# Altium project TIDA-010042-E2.PrjPcb (part 2 of 3)

## Sheet TIDA-010042-E2_Controller and Bias supply_Pg4.SchDoc: Controller and Bias Supply
size 431 x 279 mm; Date: Not shown in title block; ApprovedBy: Not shown in title block; CheckedBy: Not shown in title block; Author: Not shown in title block; CompanyName: Not shown in title block; DrawnBy: Vaibhavi; Engineer: Not shown in title block; Organization: Not shown in title block; Address1: Not shown in title block; Address2: Not shown in title block; Address3: Not shown in title block; Address4: Not shown in title block; DocumentNumber: 1; Revision: Use project parameter SCH_Rev; SheetNumber: 4; SheetTotal: 5; PageSetup: Record=PageOptions|CenterHorizontal=True|CenterVertical=True|PrintScale=1.00|XCorrection=1.00|YCorrection=1.00|PrintKind=0|BorderSize=5000000|LeftOffset=0|BottomOffset=0|Orientation=2|PaperLength=1000|PaperWidth=1000|Scale=100|PaperSource=15|PrintQuality=600|MediaType=1|DitherType=10|PaperKind=Letter|PrintScaleMode=1; CurrentTime: Not shown in title block; CurrentDate: Not shown in title block; Time: Not shown in title block; DocumentFullPathAndName: Not shown in title block; DocumentName: Not shown in title block; ModifiedDate: Not shown in title block; ImagePath: Not shown in title block
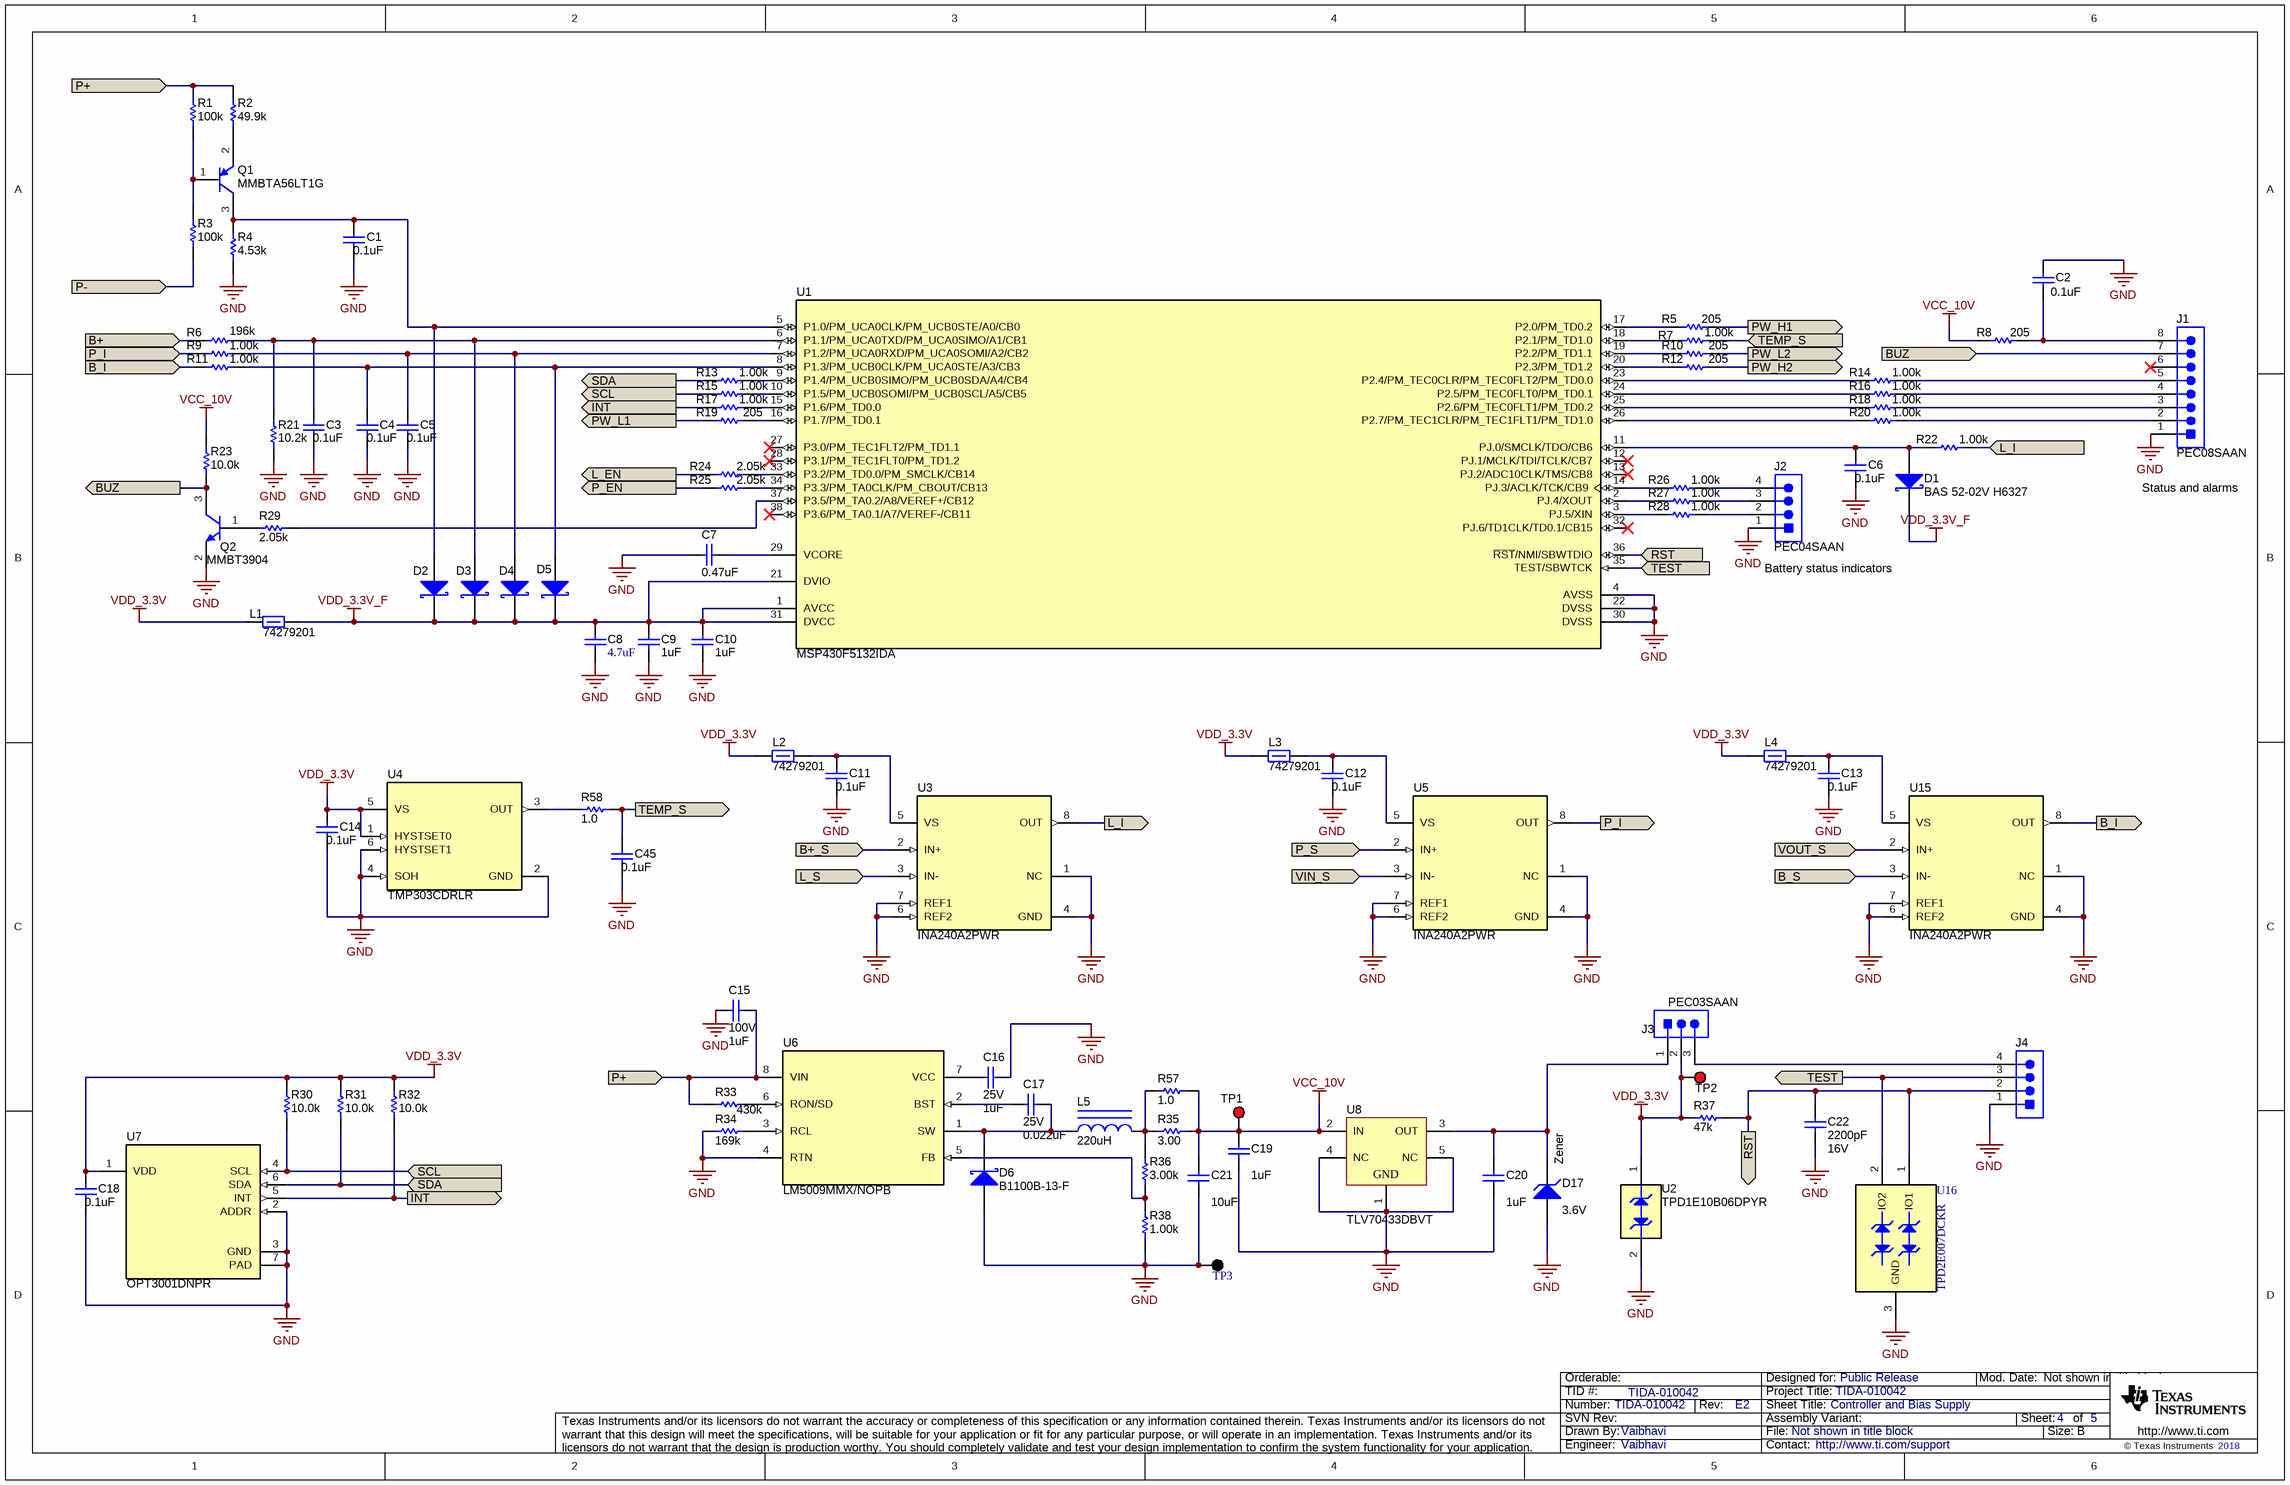
[diagram p1: TIDA-010042-E2_Controller and Bias supply_Pg4.SchDoc]

### Parts
C1  ValueDisplayed: 0.1uF  [0603]  (hidden comment: GMK107BJ104KAHT)
C2  ValueDisplayed: 0.1uF  [0603]  (hidden comment: GMK107BJ104KAHT)
C3  ValueDisplayed: 0.1uF  [0603]  (hidden comment: GMK107BJ104KAHT)
C4  ValueDisplayed: 0.1uF  [0603]  (hidden comment: GMK107BJ104KAHT)
C5  ValueDisplayed: 0.1uF  [0603]  (hidden comment: GMK107BJ104KAHT)
C6  ValueDisplayed: 0.1uF  [0603]  (hidden comment: GMK107BJ104KAHT)
C7  ValueDisplayed: 0.47uF  [0603]  (hidden comment: Capacitor)
C8  value 4.7uF  [0805_HV]  (hidden comment: LMK212B7475MGHT)
C9  ValueDisplayed: 1uF  [0805_HV]  (hidden comment: Capacitor)
C10  ValueDisplayed: 1uF  [0805_HV]  (hidden comment: Capacitor)
C11  ValueDisplayed: 0.1uF  [0603]  (hidden comment: GMK107BJ104KAHT)
C12  ValueDisplayed: 0.1uF  [0603]  (hidden comment: GMK107BJ104KAHT)
C13  ValueDisplayed: 0.1uF  [0603]  (hidden comment: GMK107BJ104KAHT)
C14  ValueDisplayed: 0.1uF  [0603]  (hidden comment: GMK107BJ104KAHT)
C15  VDC_V: 100V  ValueDisplayed: 1uF  [1206_180]  (hidden comment: C3216X7R2A105K160AA)
C16  VDC_V: 25V  ValueDisplayed: 1uF  [0805_HV]  (hidden comment: C2012X7R1H105K125AE)
C17  VDC_V: 25V  ValueDisplayed: 0.022uF  [0603]  (hidden comment: C0603C223K3RACTU)
C18  ValueDisplayed: 0.1uF  [0603]  (hidden comment: GMK107BJ104KAHT)
C19  ValueDisplayed: 1uF  [0603]  (hidden comment: C1608X7R1E105K080AB)
C20  ValueDisplayed: 1uF  [0603]  (hidden comment: C1608X7R1E105K080AB)
C21  ValueDisplayed: 10uF  [1206_190]  (hidden comment: EMK316AB7106KL-T)
C22  ValueDisplayed: 2200pF  VDC_V: 16V  [0603]  (hidden comment: 885012206036)
C45  ValueDisplayed: 0.1uF  [0603]  (hidden comment: GMK107BJ104KAHT)
D1  BAS 52-02V H6327  [SOD-523]
D2  BAS 52-02V H6327  [SOD-523]  (value not drawn)
D3  BAS 52-02V H6327  [SOD-523]  (value not drawn)
D4  BAS 52-02V H6327  [SOD-523]  (value not drawn)
D5  BAS 52-02V H6327  [SOD-523]  (value not drawn)
D6  B1100B-13-F  [SMB]
D17  Zener  value 3.6V  [SOD-123]
J1  PEC08SAAN  [SULLINS_PEC08SAAN]
J2  PEC04SAAN  [SULLINS_PEC04SAAN]
J3  PEC03SAAN  [CONN_PEC03SAAN]
J4  PEC04SAAN  [SULLINS_PEC04SAAN]  (value not drawn)
L1  74279201  [0805_HV]
L2  74279201  [0805_HV]
L3  74279201  [0805_HV]
L4  74279201  [0805_HV]
L5  ValueDisplayed: 220uH  [SLF10145]  (hidden comment: SLF10145T-221MR65-PF)
Q1  MMBTA56LT1G  [SOT-23]
Q2  MMBT3904  [SOT-23]
R1  ValueDisplayed: 100k  [0805_HV]  (hidden comment: MCU08050C1003FP500)
R2  ValueDisplayed: 49.9k  [0805_HV]  (hidden comment: CRCW080549K9FKEA)
R3  ValueDisplayed: 100k  [0805_HV]  (hidden comment: MCU08050C1003FP500)
R4  ValueDisplayed: 4.53k  [0805_HV]  (hidden comment: CRCW08054K53FKEA)
R5  ValueDisplayed: 205  [0603]  (hidden comment: RC0603FR-07205RL)
R6  ValueDisplayed: 196k  [0805_HV]  (hidden comment: CRCW0805196KFKEA)
R7  ValueDisplayed: 1.00k  [0603]  (hidden comment: Resistor)
R8  ValueDisplayed: 205  [0603]  (hidden comment: RC0603FR-07205RL)
R9  ValueDisplayed: 1.00k  [0603]  (hidden comment: Resistor)
R10  ValueDisplayed: 205  [0603]  (hidden comment: RC0603FR-07205RL)
R11  ValueDisplayed: 1.00k  [0603]  (hidden comment: Resistor)
R12  ValueDisplayed: 205  [0603]  (hidden comment: RC0603FR-07205RL)
R13  ValueDisplayed: 1.00k  [0603]  (hidden comment: Resistor)
R14  ValueDisplayed: 1.00k  [0603]  (hidden comment: Resistor)
R15  ValueDisplayed: 1.00k  [0603]  (hidden comment: Resistor)
R16  ValueDisplayed: 1.00k  [0603]  (hidden comment: Resistor)
R17  ValueDisplayed: 1.00k  [0603]  (hidden comment: Resistor)
R18  ValueDisplayed: 1.00k  [0603]  (hidden comment: Resistor)
R19  ValueDisplayed: 205  [0603]  (hidden comment: RC0603FR-07205RL)
R20  ValueDisplayed: 1.00k  [0603]  (hidden comment: Resistor)
R21  ValueDisplayed: 10.2k  [0603]  (hidden comment: RC0603FR-0710K2L)
R22  ValueDisplayed: 1.00k  [0603]  (hidden comment: Resistor)
R23  ValueDisplayed: 10.0k  [0603]  (hidden comment: ERJ-3EKF1002V)
R24  ValueDisplayed: 2.05k  [0603]  (hidden comment: RC0603FR-072K05L)
R25  ValueDisplayed: 2.05k  [0603]  (hidden comment: RC0603FR-072K05L)
R26  ValueDisplayed: 1.00k  [0603]  (hidden comment: Resistor)
R27  ValueDisplayed: 1.00k  [0603]  (hidden comment: Resistor)
R28  ValueDisplayed: 1.00k  [0603]  (hidden comment: Resistor)
R29  ValueDisplayed: 2.05k  [0603]  (hidden comment: RC0603FR-072K05L)
R30  ValueDisplayed: 10.0k  [0603]  (hidden comment: ERJ-3EKF1002V)
R31  ValueDisplayed: 10.0k  [0603]  (hidden comment: ERJ-3EKF1002V)
R32  ValueDisplayed: 10.0k  [0603]  (hidden comment: ERJ-3EKF1002V)
R33  ValueDisplayed: 430k  [0603]  (hidden comment: CRCW0603430KFKEA)
R34  ValueDisplayed: 169k  [0603]  (hidden comment: CRCW0603169KFKEA)
R35  ValueDisplayed: 3.00  [0603]  (hidden comment: CRCW06033R00JNEA)
R36  ValueDisplayed: 3.00k  [0603]  (hidden comment: RC0603FR-073KL)
R37  ValueDisplayed: 47k  [0603]  (hidden comment: RC0603JR-0747KL)
R38  ValueDisplayed: 1.00k  [0603]  (hidden comment: Resistor)
R57  ValueDisplayed: 1.0  [0603]  (hidden comment: CRCW06031R00JNEA)
R58  ValueDisplayed: 1.0  [0603]  (hidden comment: CRCW06031R00JNEA)
TP1  5000  [Keystone5000]  (value not drawn)
TP2  5000  [Keystone5000]  (value not drawn)
TP3  5001  [Keystone5001]  (value not drawn)
U1  MSP430F5132IDA  [DA0038A_N]
U2  TPD1E10B06DPYR  [DPY0002A]
U3  INA240A2PWR  [PW0008A_L]
U4  TMP303CDRLR  [DRL0006A]
U5  INA240A2PWR  [PW0008A_L]
U6  LM5009MMX/NOPB  [DGK0008A_N]
U7  OPT3001DNPR  [DNP0006A]
U8  TLV70433DBVT  [DBV0005A_N]
U15  INA240A2PWR  [PW0008A_L]
U16  TPD2E007DCKR  [DCK0003A_L]

### Ports
B+ (in), B+_S (in), B_I (in), B_I (out), B_S (in), BUZ (in), BUZ (out), INT (out), L_EN (out), L_I (in), L_I (out), L_S (in), P+ (in), P- (in), P_EN (out), P_I (in), P_I (out), P_S (in), PW_H1 (out), PW_H2 (out), PW_L1 (out), PW_L2 (out), RST (in), RST (out), SCL (in), SCL (out), SDA (in), SDA (out), TEMP_S (in), TEMP_S (out), TEST (in), TEST (out), VIN_S (in), VOUT_S (in)

### Nets
GND: C1.2 C2.1 C3.2 C4.2 C5.2 C6.2 C7.1 C8.2 C9.2 C10.2 C11.2 C12.2 C13.2 C14.2 C15.2 C16.1 C18.2 C19.2 C20.2 C21.2 C22.2 C45.2 D6.2(A) D17.2(A) J1.1 J2.1 J4.1 Q2.2(E) R4.1 R21.1 R34.1 R38.1 TP3.1 U1.4(AVSS) U1.22(DVSS) U1.30(DVSS) U2.2(A) U3.1(NC) U3.4(GND) U3.6(REF2) U3.7(REF1) U4.2(GND) U4.4(SOH) U4.6(HYSTSET1) U5.1(NC) U5.4(GND) U5.6(REF2) U5.7(REF1) U6.4(RTN) U7.2(ADDR) U7.3(GND) U7.7(PAD) U8.1(GND) U8.4(NC) U8.5(NC) U15.1(NC) U15.4(GND) U15.6(REF2) U15.7(REF1) U16.3(GND)
VCC_10V: C19.1 C21.1 R8.1 R23.1 R35.2 R57.2 TP1.1 U8.2(IN)
VDD_3.3V: C14.1 C18.1 J3.2 L1.1 L2.2 L3.2 L4.2 R30.2 R31.2 R32.2 R37.1 TP2.1 U2.1(K) U4.1(HYSTSET0) U4.5(VS) U7.1(VDD)
VDD_3.3V_F: C8.1 C9.1 C10.1 D1.1(K) D2.1(K) D3.1(K) D4.1(K) D5.1(K) L1.2 U1.1(AVCC) U1.21(DVIO) U1.31(DVCC)
B+: R6.1 U3.2(IN+) U15.3(IN-) ; port B+_S, port B_S, port B+
B_I: R11.1 U15.8(OUT) ; port B_I
BUZ: J1.7 Q2.3(C) R23.2 ; port BUZ
INT: R17.1 R32.1 U7.5(INT) ; port INT
L+: U3.3(IN-) ; port L_S
L_EN: R24.1 ; port L_EN
L_I: R22.2 U3.8(OUT) ; port L_I
P+: C15.1 R1.2 R2.2 R33.1 U5.2(IN+) U6.8(VIN) ; port P+, port P_S
P-: R3.1 ; port P-
P_EN: R25.1 ; port P_EN
P_I: R9.1 U5.8(OUT) ; port P_I
PW_H1: R5.2 ; port PW_H1
PW_H2: R12.2 ; port PW_H2
PW_L1: R19.1 ; port PW_L1
PW_L2: R10.2 ; port PW_L2
RST: C22.1 J4.2 R37.2 U1.36(~{RST}/NMI/SBWTDIO) U16.1(IO1) ; port RST
SCL: R15.1 R30.1 U7.4(SCL) ; port SCL
SDA: R13.1 R31.1 U7.6(SDA) ; port SDA
TEMP_S: C45.1 R7.2 R58.2 ; port TEMP_S
TEST: J4.3 U1.35(TEST/SBWTCK) U16.2(IO2) ; port TEST
V_IN: U5.3(IN-) ; port VIN_S
V_OUT: U15.2(IN+) ; port VOUT_S
NetC1_1: C1.1 D2.2(A) Q1.3(C) R4.2 U1.5(P1.0/PM_UCA0CLK/PM_UCB0STE/A0/CB0)
NetC2_2: C2.2 J1.8 R8.2
NetC3_1: C3.1 D3.2(A) R6.2 R21.2 U1.6(P1.1/PM_UCA0TXD/PM_UCA0SIMO/A1/CB1)
NetC4_1: C4.1 D5.2(A) R11.2 U1.8(P1.3/PM_UCB0CLK/PM_UCA0STE/A3/CB3)
NetC5_1: C5.1 D4.2(A) R9.2 U1.7(P1.2/PM_UCA0RXD/PM_UCA0SOMI/A2/CB2)
NetC6_1: C6.1 D1.2(A) R22.1 U1.11(PJ.0/SMCLK/TDO/CB6)
NetC7_2: C7.2 U1.29(VCORE)
NetC11_1: C11.1 L2.1 U3.5(VS)
NetC12_1: C12.1 L3.1 U5.5(VS)
NetC13_1: C13.1 L4.1 U15.5(VS)
NetC16_2: C16.2 U6.7(VCC)
NetC17_1: C17.1 D6.1(K) L5.1 U6.1(SW)
NetC17_2: C17.2 U6.2(BST)
NetC20_1: C20.1 D17.1(K) J3.1 U8.3(OUT)
NetJ1_2: J1.2 R20.2
NetJ1_3: J1.3 R18.2
NetJ1_4: J1.4 R16.2
NetJ1_5: J1.5 R14.2
NetJ2_2: J2.2 R28.2
NetJ2_3: J2.3 R27.2
NetJ2_4: J2.4 R26.2
NetJ3_3: J3.3 J4.4
NetL5_2: L5.2 R35.1 R36.2 R57.1
NetQ1_1: Q1.1(B) R1.1 R3.2
NetQ1_2: Q1.2(E) R2.1
NetQ2_1: Q2.1(B) R29.1
NetR5_1: R5.1 U1.17(P2.0/PM_TD0.2)
NetR7_1: R7.1 U1.18(P2.1/PM_TD1.0)
NetR10_1: R10.1 U1.19(P2.2/PM_TD1.1)
NetR12_1: R12.1 U1.20(P2.3/PM_TD1.2)
NetR13_2: R13.2 U1.9(P1.4/PM_UCB0SIMO/PM_UCB0SDA/A4/CB4)
NetR14_1: R14.1 U1.23(P2.4/PM_TEC0CLR/PM_TEC0FLT2/PM_TD0.0)
NetR15_2: R15.2 U1.10(P1.5/PM_UCB0SOMI/PM_UCB0SCL/A5/CB5)
NetR16_1: R16.1 U1.24(P2.5/PM_TEC0FLT0/PM_TD0.1)
NetR17_2: R17.2 U1.15(P1.6/PM_TD0.0)
NetR18_1: R18.1 U1.25(P2.6/PM_TEC0FLT1/PM_TD0.2)
NetR19_2: R19.2 U1.16(P1.7/PM_TD0.1)
NetR20_1: R20.1 U1.26(P2.7/PM_TEC1CLR/PM_TEC1FLT1/PM_TD1.0)
NetR24_2: R24.2 U1.33(P3.2/PM_TD0.0/PM_SMCLK/CB14)
NetR25_2: R25.2 U1.34(P3.3/PM_TA0CLK/PM_CBOUT/CB13)
NetR26_1: R26.1 U1.14(PJ.3/ACLK/TCK/CB9)
NetR27_1: R27.1 U1.2(PJ.4/XOUT)
NetR28_1: R28.1 U1.3(PJ.5/XIN)
NetR29_2: R29.2 U1.37(P3.5/PM_TA0.2/A8/VEREF+/CB12)
NetR33_2: R33.2 U6.6(RON/SD)
NetR34_2: R34.2 U6.3(RCL)
NetR36_1: R36.1 R38.2 U6.5(FB)
NetR58_1: R58.1 U4.3(OUT)

Not connected (* = marked no-connect by the designer): J1 6*; U1 12(PJ.1/MCLK/TDI/TCLK/CB7)* 13(PJ.2/ADC10CLK/TMS/CB8)* 27(P3.0/PM_TEC1FLT2/PM_TD1.1)* 28(P3.1/PM_TEC1FLT0/PM_TD1.2)* 32(PJ.6/TD1CLK/TD0.1/CB15)* 38(P3.6/PM_TA0.1/A7/VEREF-/CB11)*

### Notes on the sheet
- (near J1) Status and alarms
- (near J2) Battery status indicators
- Drawn By:
- SVN Rev:
- Number:
- TID #:
- Orderable:
- Rev:
- Sheet Title:
- File:
- Project Title:
- Designed for:
- Assembly Variant:
- Mod. Date:
- Sheet:
- Size:
- of
- B
- http://www.ti.com
- Texas Instruments and/or its licensors do not warrant the accuracy or completeness of this specification or any information contained therein. Texas Instruments and/or its licensors do not warrant that this design will meet the specifications, will be suitable for your application or fit for any particular purpose, or will operate in an implementation. Texas Instruments and/or its licensors do not warrant that the design is production worthy. You should completely validate and test your design implementation to confirm the system functionality for your application.
- Engineer:
- Contact:
- © Texas Instruments

### Library data of the parts
C1-C6 C11-C14 C18 C45 = CMP-0007044-5: CAP CER 0.1UF 25V X5R 0603; Manufacturer: Taiyo Yuden; PartNumber: TMK107BJ104KA-T; TaMin_C: -55°C; ESR_ohm: 0.0296; Polarized: N; TempCo: X7R; SizeAreaWB_mm2: 4.68; Value1: 0.0296 ohm; U/M: EA; TaMax_C: 125°C; Tolerance_%: 10%; SizeZ_mm: 1; SizeX_mm: 1.6; SizeY_mm: 0.8; SizeArea_mm2: 1.28; CompType: Capacitor; Cap_F: 100nF; IRMS_A: 9.7199dA; AEC Category: Q200; Publisher: Texas Instruments; Published: 2008-06-19; RoHS: Y; MountType: SMT; Value: 0.1uF; Supplier 1: Digi-Key; PackageReference: 0603; Cap_Case: 0603; Value2: 25V; LatestRevisionDate: 2017-03-09; AEC Qualified: N; VDC_V: 25V; ComponentLink1Description: Datasheet link; AEC Grade: N/A; Supplier Part Number 1: 587-1245-1-ND; Technology: Ceramic; ComponentLink1URL: https://product.tdk.com/en/search/capacitor/ceramic/mlcc/info?part_no=C1608X7R1H104K080AA
C7 = CMP-0007328-5: CAP, CERM, 0.47 uF, 10 V, +/- 10%, X5R, 0603; PartNumber: GRM188R61A474KA61D; Manufacturer: MuRata; Polarized: N; Value: 0.47uF; U/M: EA; Cap_F: 470nF; Value1: Unknown; VDC_V: 10V; TaMin_C: -55°C; TaMax_C: 85°C; SizeArea_mm2: 1.28; SizeAreaWB_mm2: 4.68; SizeX_mm: 1.6; SizeY_mm: 0.8; SizeZ_mm: 1; AEC Category: Q200; CompType: Capacitor; PackageReference: 0603; RoHS: Y; Tolerance_%: 10%; Value2: 10V; MountType: SMT; Technology: Ceramic; TempCo: X5R; Cap_Case: 0603; Published: 2008-06-19; Publisher: Texas Instruments; LatestRevisionDate: 2017-03-09; ComponentLink1Description: Datasheet link; ComponentLink1URL: http://search.murata.co.jp/Ceramy/PnsearchViewAction.do?HnOFG=ON&HnNFG=ON&SEL_CNT=50&sLang=en&sKey=GRM188R61A474KA61D&x=9&y=9&search=startwith; Supplier 1: Digi-Key; Supplier Part Number 1: 490-1539-1-ND; Supplier 2: Mouser; Supplier Part Number 2: 81-GRM39R474K10; Supplier 3: Farnell; Supplier Part Number 3: 1403755; AEC Qualified: ?
C8 = CMP-0007690-2: CAP, CERM, 4.7 uF, 10 V, +/- 10%, X7R, 0805; Manufacturer: Taiyo Yoden; TaMin_C: -55°C; Polarized: N; SizeAreaWB_mm2: 6.75; Value1: Unknown; U/M: EA; TaMax_C: 125°C; SizeZ_mm: 1.45; SizeX_mm: 2; SizeY_mm: 1.25; Cap_Case: 0805; Value2: 10V; SizeArea_mm2: 2.5; CompType: Capacitor; Cap_F: 4.7µF; AEC Category: Q200; Publisher: Texas Instruments; TempCo: X7R; Published: 2008-06-19; RoHS: Y; MountType: SMT; Supplier 1: Digi-Key; PackageReference: 0805; Tolerance_%: 10%; LatestRevisionDate: 2017-03-09; PartNumber: LMK212B7475MGHT; AEC Qualified: N; VDC_V: 10V; ComponentLink1Description: Datasheet link; AEC Grade: N/A; Supplier Part Number 1: 587-4916-1-ND; Technology: Ceramic; ValueDisplayed: 4.7uF; ComponentLink1URL: http://katalog.we-online.de/pbs/datasheet/885012207025.pdf
C9 C10 = CMP-0064942-2: CAP, CERM, 1 uF, 10 V,+/- 10%, X7R, AEC-Q200 Grade 1, 0805; PartNumber: C0805C105K8RACAUTO; Manufacturer: Kemet; Polarized: N; Value: 1uF; U/M: EA; Cap_F: 1µF; Value1: Unknown; VDC_V: 10V; TaMin_C: -55°C; TaMax_C: 125°C; Cap_Case: 0805; SizeArea_mm2: 2.5; SizeAreaWB_mm2: 6.75; SizeX_mm: 2; SizeY_mm: 1.25; SizeZ_mm: 1.45; AEC Category: Q200; AEC Qualified: Y; AEC Grade: 1; CompType: Capacitor; PackageReference: 0805; RoHS: Y; Tolerance_%: 10%; Value2: 10V; MountType: SMT; Technology: Ceramic; TempCo: X7R; Published: 2008-06-19; Publisher: Texas Instruments; LatestRevisionDate: 2017-06-05; ComponentLink1Description: Datasheet link; ComponentLink1URL: http://www.kemet.com/docfinder?Partnumber=C0805C105K8RACAUTO; Supplier 1: Digi-Key; Supplier Part Number 1: 399-6931-1-ND; Supplier 2: Newark; Supplier Part Number 2: 47Y9732; Supplier 3: Mouser; Supplier Part Number 3: 80-C0805C105K8RAUTO
C15 = CMP-0008710-2: CAP, CERM, 1 uF, 100 V, +/- 10%, X7R, 1206; Manufacturer: TDK; PartNumber: C3216X7R2A105M160AA; TaMin_C: -55°C; ESR_ohm: 4.575m; Polarized: N; SizeAreaWB_mm2: 10.92; Value1: 0.004575 ohm; U/M: EA; Value: 1uF; TaMax_C: 125°C; SizeZ_mm: 1.8; SizeX_mm: 3.2; SizeY_mm: 1.6; SizeArea_mm2: 5.12; Cap_F: 1µF; IRMS_A: 3.39639A; AEC Category: Q200; Publisher: Texas Instruments; TempCo: X7R; Published: 2008-06-19; RoHS: Y; MountType: SMT; Supplier 1: Digi-Key; PackageReference: 1206; Tolerance_%: 10%; Cap_Case: 1206_180; Value2: 100V; CompType: Capacitor; LatestRevisionDate: 2017-03-09; AEC Qualified: N; ComponentLink1Description: Datasheet link; AEC Grade: N/A; Supplier Part Number 1: 445-4468-2-ND; Technology: Ceramic; ComponentLink1URL: https://product.tdk.com/en/search/capacitor/ceramic/mlcc/info?part_no=C3216X7R2A105K160AA
C16 = CMP-0007730-2: CAP CER 1UF 25V X7R 0805; Manufacturer: Wurth Electronics Inc.; PartNumber: 885012207078; TaMin_C: -55°C; Polarized: N; SizeAreaWB_mm2: 6.75; Value1: Unknown; U/M: EA; TaMax_C: 125°C; Tolerance_%: 10%; SizeZ_mm: 1.45; SizeX_mm: 2; SizeY_mm: 1.25; Cap_Case: 0805; SizeArea_mm2: 2.5; CompType: Capacitor; Cap_F: 1µF; AEC Category: Q200; Publisher: Texas Instruments; TempCo: X7R; Published: 2008-06-19; RoHS: Y; MountType: SMT; Value: 1uF; Supplier 1: Digi-Key; PackageReference: 0805; Value2: 25V; LatestRevisionDate: 2017-03-09; AEC Qualified: N; ComponentLink1Description: Datasheet link; AEC Grade: N/A; Supplier Part Number 1: 732-7672-1-ND; Technology: Ceramic; ComponentLink1URL: http://www.kemet.com/docfinder?Partnumber=C0805C105K5RACTU
C17 = CMP-0006899-4: CAP CER 0.022UF 25V X7R 0603; Manufacturer: Samsung Electro-Mechanics; PartNumber: CL10B223KA8NNWC; TaMin_C: -55°C; Polarized: N; SizeAreaWB_mm2: 4.68; Value1: Unknown; U/M: EA; TaMax_C: 125°C; Tolerance_%: 10%; SizeZ_mm: 1; SizeX_mm: 1.6; SizeY_mm: 0.8; SizeArea_mm2: 1.28; CompType: Capacitor; Cap_F: 22nF; AEC Category: Q200; Publisher: Texas Instruments; TempCo: X7R; Published: 2008-06-19; RoHS: Y; MountType: SMT; Value: 0.022uF; Supplier 1: Digi-Key; PackageReference: 0603; Cap_Case: 0603; Value2: 25V; LatestRevisionDate: 2017-03-09; AEC Qualified: ?; ComponentLink1Description: Datasheet link; Supplier Part Number 1: 1276-2000-1-ND; Technology: Ceramic; ComponentLink1URL: http://www.kemet.com/kemet/web/homepage/kechome.nsf/vapubfiles/F3102_Y5V.pdf/$file/F3102_Y5V.pdf
C19 C20 = CMP-0006831-4: CAP CER 1UF 16V Y5V 0603; Manufacturer: Yageo; PartNumber: CC0603MRY5V7BB105; TaMin_C: -55°C; Polarized: N; TempCo: X7R; SizeAreaWB_mm2: 4.68; Value1: Unknown; U/M: EA; TaMax_C: 125°C; Tolerance_%: 10%; SizeZ_mm: 1; SizeX_mm: 1.6; SizeY_mm: 0.8; SizeArea_mm2: 1.28; CompType: Capacitor; Cap_F: 1µF; AEC Category: Q200; Publisher: Texas Instruments; Published: 2008-06-19; RoHS: Y; MountType: SMT; Value: 1uF; Supplier 1: Digi-Key; PackageReference: 0603; Cap_Case: 0603; Value2: 16V; LatestRevisionDate: 2017-03-09; AEC Qualified: N; VDC_V: 16V; ComponentLink1Description: Datasheet link; AEC Grade: N/A; Supplier Part Number 1: 311-3414-1-ND; Technology: Ceramic; ComponentLink1URL: http://katalog.we-online.de/pbs/datasheet/885012206052.pdf
C21 = CMP-0008570-2: CAP CER 10UF 16V X7R 1206; Manufacturer: Samsung Electro-Mechanics; PartNumber: CL31B106KOHZW6E; TaMin_C: -55°C; Polarized: N; SizeAreaWB_mm2: 10.92; Value1: Unknown; U/M: EA; TaMax_C: 125°C; Tolerance_%: 10%; SizeZ_mm: 1.9; SizeX_mm: 3.2; SizeY_mm: 1.6; Cap_Case: 1206; SizeArea_mm2: 5.12; CompType: Capacitor; Cap_F: 10µF; AEC Category: Q200; Publisher: Texas Instruments; TempCo: X7R; Published: 2008-06-19; RoHS: Y; MountType: SMT; Value: 10uF; Supplier 1: Digi-Key; PackageReference: 1206_190; Value2: 16V; LatestRevisionDate: 2017-03-09; AEC Qualified: N; VDC_V: 16V; ComponentLink1Description: Datasheet link; AEC Grade: N/A; Supplier Part Number 1: 1276-7032-1-ND; Technology: Ceramic; ComponentLink1URL: http://datasheets.avx.com/X7RDielectric.pdf
C22 = CMP-0006827-4: CAP, CERM, 2200 pF, 16 V, +/- 10%, X7R, 0603; Manufacturer: Wurth Elektronik; Polarized: N; Value: 2200pF; U/M: EA; Cap_F: 2.2nF; Value1: Unknown; TaMin_C: -55°C; TaMax_C: 125°C; SizeArea_mm2: 1.28; SizeAreaWB_mm2: 4.68; SizeX_mm: 1.6; SizeY_mm: 0.8; SizeZ_mm: 1; AEC Category: Q200; CompType: Capacitor; PartNumber: 885012206036; PackageReference: 0603; RoHS: Y; Tolerance_%: 10%; Value2: 16V; MountType: SMT; Technology: Ceramic; TempCo: X7R; Cap_Case: 0603; Published: 2008-06-19; Publisher: Texas Instruments; LatestRevisionDate: 2017-03-09; ComponentLink1Description: Datasheet link; ComponentLink1URL: http://katalog.we-online.de/pbs/datasheet/885012206036.pdf; Supplier 1: Mouser; Supplier Part Number 1: 710-885012206036; AEC Qualified: N; AEC Grade: N/A
D1-D5 = CMP-0028606-2: Diode, Schottky, 45 V, 0.75 A, SOD-523; Manufacturer: Infineon Technologies; Io_A: 7.5dA; Green_Lifecycle: Not Set; SizeAreaWB_mm2: 5.13; Vr_V: 45V; Green_REACh: Incomplete; Value1: 0.75A; TJmax_C: 150°C; U/M: EA; Value: 45V; SizeZ_mm: 0.65; SizeX_mm: 1.7; SizeY_mm: 0.9; Vf_V: 6dV; Value2: 0.6V; SizeArea_mm2: 1.53; AEC Category: Q101; ComponentLink1URL: http://www.infineon.com/dgdl/bas52series.pdf?folderId=db3a304313d846880113def5812204a1&fileId=db3a304313e278750113e2a3a5490006; Supplier Part Number 2: 726-BAS5202VH6327; Publisher: Texas Instruments; Supplier 2: Mouser; Published: 2008-06-26; RoHS: Y; MountType: SMT; Green_EU RoHS-2: Incomplete; Supplier 1: Digi-Key; Green_EU RoHS: Incomplete; PackageReference: SOD-523; CompType: Diode; Type: Schottky; LatestRevisionDate: 2017-05-08; PartNumber: BAS 52-02V H6327; AEC Qualified: ?; ComponentLink1Description: Datasheet link; Supplier Part Number 1: BAS 52-02V H6327CT-ND
D6 = CMP-0028372-1: Diode, Schottky, 100 V, 1 A, SMB; Manufacturer: Diodes Inc.; Io_A: 1A; Green_Lifecycle: Not Set; SizeAreaWB_mm2: 44.156; Vr_V: 100V; Green_REACh: Incomplete; TJmax_C: 150°C; U/M: EA; Value: 100V; SizeZ_mm: 2.6; SizeX_mm: 5.6; SizeY_mm: 3.81; Vf_V: 7.9dV; Value2: 0.79V; SizeArea_mm2: 21.336; AEC Category: Q101; RJC_CperW: 25; ComponentLink1URL: http://www.diodes.com/datasheets/ds30018.pdf; Supplier Part Number 2: 621-B1100B-F; Publisher: Texas Instruments; Supplier 2: Mouser; Published: 2008-06-26; RoHS: Y; Value1: 1A; MountType: SMT; Green_EU RoHS-2: Incomplete; Supplier 1: Digi-Key; Green_EU RoHS: Incomplete; PackageReference: SMB; CompType: Diode; Type: Schottky; LatestRevisionDate: 2017-05-08; PartNumber: B1100B-13-F; AEC Qualified: ?; ComponentLink1Description: Datasheet link; Supplier Part Number 1: B1100B-FDICT-ND
D17 = CMP-0005782-1: Diode, Zener, 3.6 V, 500 mW, SOD-123; PartNumber: MMSZ4685T1G; Manufacturer: ON Semiconductor; U/M: EA; Power_W: 500mW; Value1: 0.5W; RJA_CperW: 340; SizeAreaWB_mm2: 13.095; SizeArea_mm2: 6.545; SizeX_mm: 3.85; SizeY_mm: 1.7; SizeZ_mm: 1.35; AEC Category: Q101; PackageReference: SOD-123; CompType: Zener; Vz_V: 3.6V; MountType: SMT; RoHS: Y; ComponentLink1Description: Datasheet link; ComponentLink1URL: http://www.onsemi.com/pub_link/Collateral/MMSZ4678T1-D.PDF; Published: 2008-10-08; Publisher: Texas Instruments; LatestRevisionDate: 2017-03-09; LatestRevisionNote: Updated Supplier Data; Supplier 1: Digi-Key; Supplier Part Number 1: MMSZ4685T1GOSCT-ND; Supplier 2: Mouser; Supplier Part Number 2: 863-MMSZ4685T1G; Supplier 3: Farnell; Supplier Part Number 3: 1651592; AEC Qualified: ?
J1 = CMP-0054563-1: Header, 100mil, 8x1, Tin, TH; Manufacturer: Sullins Connector Solutions; CNHeader: TRUE; Current_A: 3A; Green_Lifecycle: Not Set; Shrouded: N; Gender: Male; Green_REACh: Incomplete; Voltage_V: 1.8kV; Row_Count: 1; Pitch_mm: 2.54; CT: FALSE; Cert_UL: Y; ComponentLink1URL: http://www.sullinscorp.com/catalogs/77_PAGE108-109_.100_MALE_HDR.pdf; ClassName: Header; Publisher: Texas Instruments; Color: Black; RoHS: Y; MountType: TH; Green_EU RoHS-2: Incomplete; Supplier 1: Digi-Key; Green_EU RoHS: Incomplete; PackageReference: Header, 8x1, 100mil, TH; PinCount: 8; CompType: Header; LatestRevisionDate: 26/05/2017; PartNumber: PEC08SAAN; Orientation: Vertical; ComponentLink1Description: Datasheet URL; Supplier Part Number 1: S1012E-08-ND; ContactFinish: Tin
J2 J4 = CMP-0054562-1: Header, 100mil, 4x1, Tin, TH; Manufacturer: Sullins Connector Solutions; CNHeader: TRUE; Current_A: 3A; Green_Lifecycle: Not Set; Shrouded: N; Gender: Male; Green_REACh: Incomplete; Voltage_V: 1.8kV; Row_Count: 1; Pitch_mm: 2.54; CT: FALSE; Cert_UL: Y; ComponentLink1URL: http://www.sullinscorp.com/catalogs/77_PAGE108-109_.100_MALE_HDR.pdf; ClassName: Header; Publisher: Texas Instruments; Color: Black; RoHS: Y; MountType: TH; Green_EU RoHS-2: Incomplete; Supplier 1: Digi-Key; Green_EU RoHS: Incomplete; PackageReference: Header, 4x1, 100mil, TH; PinCount: 4; CompType: Header; LatestRevisionDate: 26/05/2017; PartNumber: PEC04SAAN; Orientation: Vertical; ComponentLink1Description: Datasheet URL; Supplier Part Number 1: S1012E-04-ND; ContactFinish: Tin
J3 = CMP-0002338-1: Header, 100mil, 3x1, Tin, TH; Manufacturer: Sullins Connector Solutions; CNHeader: TRUE; Current_A: 3A; Green_Lifecycle: Not Set; Shrouded: N; Gender: Male; Green_REACh: Incomplete; Voltage_V: 1.8kV; Row_Count: 1; Pitch_mm: 2.54; CT: FALSE; Cert_UL: Y; ComponentLink1URL: http://www.sullinscorp.com/catalogs/77_PAGE108-109_.100_MALE_HDR.pdf; ClassName: Header; Publisher: Texas Instruments; Color: Black; RoHS: Y; MountType: TH; Green_EU RoHS-2: Incomplete; Supplier 1: Digi-Key; Green_EU RoHS: Incomplete; PackageReference: Header, 3 PIN, 100mil, Tin; PinCount: 3; CompType: Header; LatestRevisionDate: 26/05/2017; PartNumber: PEC03SAAN; Orientation: Vertical; ComponentLink1Description: Datasheet URL; Supplier Part Number 1: S1012E-03-ND; ContactFinish: Tin
L1-L4 = CMP-0003066-1: Ferrite Bead, 32 ohm @ 100 MHz, 0.5 A, 0805; Manufacturer: Wurth Elektronik; Ztyp@1GHz_Ohm: 72.401; ZTyp@100MHz_Ohm: 32; SizeAreaWB_mm2: 6.75; DCR_ohm: 1.5d; Value1: 0.15 ohm; Value: 32 ohm; Imax_A: 5dA; SizeZ_mm: 1.45; SizeX_mm: 2; SizeY_mm: 1.25; Value2: 0.5A; SizeArea_mm2: 2.5; ComponentLink1URL: http://katalog.we-online.de/pbs/datasheet/74279201.pdf; Supplier Part Number 2: 710-74279201; Publisher: Texas Instruments; Supplier 2: Mouser; Published: 2014-04-30; RoHS: Y; MountType: SMT; Supplier 1: Digi-Key; PackageReference: 0805; CompType: Ferrite Bead; LatestRevisionDate: 2017-03-09; PartNumber: 74279201; ComponentLink1Description: Datasheet link; Supplier Part Number 1: 732-1599-1-ND; ValueDisplayed: 32 ohm
L5 = CMP-0063178-2: Inductor, Shielded Drum Core, Ferrite, 220 uH, 0.65 A, 0.47 ohm, SMD; Manufacturer: TDK; Isat: 0.65A @ 10% inductance drop; Irms: 0.7A @ 30C rise; Green_Lifecycle: Active; SizeAreaWB_mm2: 146.41; DCR_ohm: 4.7d; Green_REACh: Passed; Value: 220uH; Imax_A: 6.5dA; SizeZ_mm: 4.5; SizeX_mm: 10.1; Value2: 0.65A; SizeArea_mm2: 102.01; Ind_H: 220µH; AEC Category: Q200; Supplier Part Number 2: 810-SLF10145T-221M; Publisher: Texas Instruments; Supplier 2: Mouser; Supplier Part Number 3: 1669999; Supplier 3: Farnell; Published: 2008-06-26; RoHS: Y; Value1: 0.47 ohm; Material: Ferrite; MountType: SMT; Green_EU RoHS-2: Incomplete; Supplier 1: Digi-Key; Green_EU RoHS: Passed; PackageReference: SLF10145; SizeY_mm: 10.1; CompType: Inductor; LatestRevisionDate: 2017-06-02; PartNumber: SLF10145T-221MR65-PF; AEC Qualified: ?; ComponentLink1Description: Datasheet link; Supplier Part Number 1: 445-1982-1-ND; Technology: Shielded Drum Core; ComponentLink1URL: http://www.tdk.co.jp/tefe02/e531_slf10145.pdf
Q1 = CMP-0000338-2: Transistor, PNP, 80 V, 0.5 A, SOT-23; Manufacturer: ON Semiconductor; TaMax_C: 150°C; Value1: 0.5 A; Vcesat1_V: 2.5dV; SizeX_mm: 2.5; SizeY_mm: 3; TaMin_C: -55°C; IcRated_A: 5dA; CompType: BJT; SizeZ_mm: 1.1; Value: 80 V; SizeArea_mm2: 7.5; NPN: 0; Vceo_V: 80V; PNP: 1; AEC Category: Q101; SizeAreaWB_mm2: 14; U/M: EA; Supplier 1: Digi-Key; Supplier Part Number 1: MMBTA56-TPCT-ND; PartNumber: MMBTA56LT1G; LatestRevisionDate: 2017-03-09; Publisher: Texas Instruments; AEC Qualified: ?; ComponentLink1Description: Datasheet link; Published: 2008-07-31; RoHS: Y; PackageReference: SOT-23; MountType: SMT; ComponentLink1URL: http://www.onsemi.com/pub_link/Collateral/MMBTA55LT1-D.PDF
Q2 = CMP-0000386-2: TRANS NPN 40V 0.2A SOT23; PartNumber: MMBT3904-TP; Manufacturer: Micro Commercial Co; TaMax_C: 150°C; Value2: 300; Vcesat1_V: 2dV; SizeX_mm: 2.5; SizeY_mm: 3; TaMin_C: -55°C; IcRated_A: 2dA; CompType: BJT; SizeZ_mm: 1.1; SizeArea_mm2: 7.5; NPN: 1; PNP: 0; AEC Category: Q101; SizeAreaWB_mm2: 14; U/M: EA; Supplier 1: Digi-Key; Supplier Part Number 1: MMBT3904TPMSCT-ND; Value1: 0.2 A; LatestRevisionDate: 2017-03-09; Publisher: Texas Instruments; AEC Qualified: ?; ComponentLink1Description: Datasheet link; HfeMax: 300; Value: 40 V; Published: 2008-07-31; RoHS: Y; Vceo_V: 40V; PackageReference: SOT-23; MountType: SMT; ComponentLink1URL: http://www.fairchildsemi.com/ds/MM/MMBT3904.pdf
R1 R3 = CMP-0021858-2: RES, 100 k, 1%, 0.2 W, 0805; Manufacturer: Vishay/Beyschlag; Power_W: 200mW; TempCo: 50 ppm/C; U/M: EA; Value: 100k; EIA_Code: E96; SizeX_mm: 2; SizeY_mm: 1.25; SizeZ_mm: 1.45; Value2: 0.2W; SizeArea_mm2: 2.5; AEC Qualified: N; VDC_V: 150V; AEC Category: Q200; Supplier Part Number 2: 64P5579; Publisher: Texas Instruments; Supplier 2: Newark; Supplier Part Number 3: 94-MCU08050C1003FP5; Supplier 3: Mouser; Published: 2008-06-26; Value_Code: 100k; RoHS: Y; Value1: 1%; MountType: SMT; Supplier 1: Digi-Key; PackageReference: 0805; Tolerance_%: 1%; Res_ohm: 100k; CompType: Resistor; LatestRevisionDate: 2017-03-09; PartNumber: MCU08050C1003FP500; ComponentLink1Description: Datasheet link; AEC Grade: N/A; Supplier Part Number 1: MCU0805-100K-CFCT-ND; Technology: Thin Film; ComponentLink1URL: http://www.vishay.com/docs/28705/mcx0x0xpro.pdf
R2 = CMP-0021283-3: RES, 49.9 k, 1%, 0.125 W, AEC-Q200 Grade 0, 0805; Manufacturer: Vishay-Dale; Power_W: 125mW; TempCo: 100 ppm/C; Value_Code: 49k9; Value: 49.9k; EIA_Code: E96; SizeX_mm: 2; SizeY_mm: 1.25; SizeZ_mm: 1.45; Value2: 0.125W; SizeArea_mm2: 2.5; AEC Qualified: Y; VDC_V: 150V; AEC Category: Q200; AEC Grade: 0; Supplier Part Number 2: 53K0291; Supplier 2: Newark; Supplier Part Number 3: 71-CRCW0805-49.9K-E3; Supplier 3: Mouser; RoHS: E; Value1: 1%; MountType: SMT; Supplier 1: Digi-Key; PackageReference: 0805; Tolerance_%: 1%; Res_ohm: 49.9k; CompType: Resistor; PartNumber: CRCW080549K9FKEA; ComponentLink1Description: Datasheet link; Supplier Part Number 1: 541-49.9KCCT-ND; Technology: Thick Film; ComponentLink1URL: http://www.vishay.com/docs/20035/dcrcwe3.pdf
R4 = CMP-0021290-3: RES, 4.53 k, 1%, 0.125 W, AEC-Q200 Grade 0, 0805; Manufacturer: Vishay-Dale; Power_W: 125mW; TempCo: 100 ppm/C; Value_Code: 4k53; Value: 4.53k; EIA_Code: E96; SizeX_mm: 2; SizeY_mm: 1.25; SizeZ_mm: 1.45; Value2: 0.125W; SizeArea_mm2: 2.5; AEC Qualified: Y; VDC_V: 150V; AEC Category: Q200; AEC Grade: 0; Supplier Part Number 2: 53K0213; Supplier 2: Newark; Supplier Part Number 3: 71-CRCW08054K53FKEA; Supplier 3: Mouser; RoHS: E; Value1: 1%; MountType: SMT; Supplier 1: Digi-Key; PackageReference: 0805; Tolerance_%: 1%; Res_ohm: 4.53k; CompType: Resistor; PartNumber: CRCW08054K53FKEA; ComponentLink1Description: Datasheet link; Supplier Part Number 1: 541-4.53KCCT-ND; Technology: Thick Film; ComponentLink1URL: http://www.vishay.com/docs/20035/dcrcwe3.pdf
R5 R8 R10 R12 R19 = CMP-0022904-5: RES, 205, 1%, 0.1 W, 0603; Manufacturer: Yageo; Power_W: 100mW; TempCo: 100 ppm/C; Value_Code: 205R; Value: 205; EIA_Code: E96; SizeX_mm: 1.6; SizeY_mm: 0.8; SizeZ_mm: 1; Value2: 0.1W; SizeArea_mm2: 1.28; AEC Qualified: N; VDC_V: 75V; AEC Category: Q200; SizeAreaWB_mm2: 4.68; Supplier Part Number 2: 603-RC0603FR-07205RL; Supplier 2: Mouser; Supplier Part Number 3: 1799331; Supplier 3: Farnell; RoHS: Y; Value1: 1%; MountType: SMT; Supplier 1: Digi-Key; PackageReference: 0603; Tolerance_%: 1%; Res_ohm: 205; CompType: Resistor; PartNumber: RC0603FR-07205RL; ComponentLink1Description: Datasheet link; Supplier Part Number 1: 311-205HRCT-ND; Technology: Thick Film; ComponentLink1URL: http://www.yageo.com/pdf/Pu-RC0603_51_PbFree_L_2.pdf; AEC Grade: N/A
R6 = CMP-0020945-3: RES SMD 196K OHM 1% 1/8W 0805; Manufacturer: Vishay-Dale; PartNumber: ERJ-6ENF1963V; Power_W: 125mW; TempCo: 100 ppm/C; EIA_Code: E96; SizeX_mm: 2; SizeY_mm: 1.25; SizeZ_mm: 1.45; Value2: 0.125W; SizeArea_mm2: 2.5; CompType: Resistor; AEC Qualified: Y; VDC_V: 150V; AEC Category: Q200; AEC Grade: 0; Value_Code: 196k; RoHS: E; Value1: 1%; MountType: SMT; Value: 196k; Supplier 1: Digi-Key; PackageReference: 0805; Tolerance_%: 1%; Res_ohm: 196k; ComponentLink1Description: Datasheet link; Supplier Part Number 1: P196KCCT-ND; Technology: Thick Film; ComponentLink1URL: http://www.vishay.com/docs/20035/dcrcwe3.pdf
R7 R9 R11 R13-R18 R20 R22 R26-R28 R38 = CMP-0023403-3: RES, 1.00 k, 0.1%, 0.1 W, 0603; PartNumber: RG1608P-102-B-T5; Manufacturer: Susumu Co Ltd; Value: 1.00k; Res_ohm: 1k; Value_Code: 1k00; Power_W: 100mW; Value2: 0.1W; VDC_V: 75V; TempCo: 25 ppm/C; SizeArea_mm2: 1.28; SizeX_mm: 1.6; SizeY_mm: 0.8; SizeZ_mm: 1; EIA_Code: E192; U/M: EA; AEC Category: Q200; CompType: Resistor; PackageReference: 0603; RoHS: Y; Tolerance_%: 0.1%; Value1: 0.1%; MountType: SMT; Technology: Metal Film; Published: 2008-06-26; Publisher: Texas Instruments; LatestRevisionDate: 2017-03-09; ComponentLink1Description: Datasheet link; ComponentLink1URL: http://www.susumu.co.jp/english/pdf/products-j01-01.pdf; Supplier 1: Digi-Key; Supplier Part Number 1: RG16P1.0KBCT-ND; Supplier 2: Mouser; Supplier Part Number 2: 754-RG1608P-102-B-T5; Supplier 3: Farnell; Supplier Part Number 3: 1797076; AEC Qualified: ?
R21 = CMP-0022743-5: RES, 10.2 k, 1%, 0.1 W, 0603; Manufacturer: Yageo; Power_W: 100mW; TempCo: 100 ppm/C; Value_Code: 10k2; Value: 10.2k; EIA_Code: E96; SizeX_mm: 1.6; SizeY_mm: 0.8; SizeZ_mm: 1; Value2: 0.1W; SizeArea_mm2: 1.28; AEC Qualified: N; VDC_V: 75V; AEC Category: Q200; SizeAreaWB_mm2: 4.68; Supplier Part Number 2: 603-RC0603FR-0710K2L; Supplier 2: Mouser; Supplier Part Number 3: 1117235; Supplier 3: Farnell; RoHS: Y; Value1: 1%; MountType: SMT; Supplier 1: Digi-Key; PackageReference: 0603; Tolerance_%: 1%; Res_ohm: 10.2k; CompType: Resistor; PartNumber: RC0603FR-0710K2L; ComponentLink1Description: Datasheet link; Supplier Part Number 1: 311-10.2KHRCT-ND; Technology: Thick Film; ComponentLink1URL: http://www.yageo.com/pdf/Pu-RC0603_51_PbFree_L_2.pdf; AEC Grade: N/A
R23 R30-R32 = CMP-0022684-3: RES, 10.0 k, 1%, 0.1 W, 0603; Manufacturer: Panasonic; Power_W: 100mW; TempCo: 100 ppm/C; Value_Code: 10k0; U/M: EA; Value: 10.0k; EIA_Code: E96; Res_ohm: 10k; SizeX_mm: 1.6; SizeY_mm: 0.8; SizeZ_mm: 1; Value2: 0.1W; SizeArea_mm2: 1.28; VDC_V: 75V; AEC Category: Q200; Supplier Part Number 2: 64R5309; Publisher: Texas Instruments; Supplier 2: Newark; Supplier Part Number 3: 667-ERJ-3EKF1002V; Supplier 3: Mouser; Published: 2008-06-26; RoHS: Y; Value1: 1%; MountType: SMT; Supplier 1: Digi-Key; PackageReference: 0603; Tolerance_%: 1%; CompType: Resistor; LatestRevisionDate: 2017-03-09; PartNumber: ERJ-3EKF1002V; AEC Qualified: ?; ComponentLink1Description: Datasheet link; Supplier Part Number 1: P10.0KHCT-ND; Technology: Thick Film; ComponentLink1URL: http://industrial.panasonic.com/www-data/pdf/AOA0000/AOA0000CE2.pdf
R24 R25 R29 = CMP-0022981-5: RES, 2.05 k, 1%, 0.1 W, 0603; Manufacturer: Yageo; Power_W: 100mW; TempCo: 100 ppm/C; Value_Code: 2k05; Value: 2.05k; EIA_Code: E96; SizeX_mm: 1.6; SizeY_mm: 0.8; SizeZ_mm: 1; Value2: 0.1W; SizeArea_mm2: 1.28; AEC Qualified: N; VDC_V: 75V; AEC Category: Q200; SizeAreaWB_mm2: 4.68; Supplier Part Number 2: 603-RC0603FR-072K05L; Supplier Part Number 3: 1117250; Supplier 3: Farnell; RoHS: Y; Value1: 1%; MountType: SMT; Supplier 1: Digi-Key; PackageReference: 0603; Tolerance_%: 1%; Res_ohm: 2.05k; CompType: Resistor; PartNumber: RC0603FR-072K05L; Supplier 2: Mouser; ComponentLink1Description: Datasheet link; Supplier Part Number 1: 311-2.05KHRCT-ND; Technology: Thick Film; ComponentLink1URL: http://www.yageo.com/pdf/Pu-RC0603_51_PbFree_L_2.pdf; AEC Grade: N/A
R33 = CMP-0022420-4: RES, 430 k, 1%, 0.1 W, AEC-Q200 Grade 0, 0603; Manufacturer: Vishay-Dale; Power_W: 100mW; TempCo: 100 ppm/C; Value: 430k; EIA_Code: E96; SizeX_mm: 1.6; SizeY_mm: 0.8; SizeZ_mm: 1; Value2: 0.1W; SizeArea_mm2: 1.28; AEC Qualified: Y; VDC_V: 75V; AEC Category: Q200; AEC Grade: 0; ComponentLink1URL: http://www.vishay.com/docs/20035/dcrcwe3.pdf; Supplier Part Number 2: 51P0295; Supplier 2: Newark; Value_Code: 430k; RoHS: E; Value1: 1%; MountType: SMT; Supplier 1: Digi-Key; PackageReference: 0603; Tolerance_%: 1%; Res_ohm: 430k; CompType: Resistor; PartNumber: CRCW0603430KFKEA; ComponentLink1Description: Datasheet link; Supplier Part Number 1: 541-430KHCT-ND; Technology: Thick Film; Supplier 3: Mouser; Supplier Part Number 3: 71-CRCW0603-430K-E3
R34 = CMP-0022077-4: RES, 169 k, 1%, 0.1 W, AEC-Q200 Grade 0, 0603; Manufacturer: Vishay-Dale; Power_W: 100mW; TempCo: 100 ppm/C; Value: 169k; EIA_Code: E96; SizeX_mm: 1.6; SizeY_mm: 0.8; SizeZ_mm: 1; Value2: 0.1W; SizeArea_mm2: 1.28; AEC Qualified: Y; VDC_V: 75V; AEC Category: Q200; AEC Grade: 0; ComponentLink1URL: http://www.vishay.com/docs/20035/dcrcwe3.pdf; Supplier Part Number 2: 52K8184; Supplier 2: Newark; Value_Code: 169k; RoHS: E; Value1: 1%; MountType: SMT; Supplier 1: Digi-Key; PackageReference: 0603; Tolerance_%: 1%; Res_ohm: 169k; CompType: Resistor; PartNumber: CRCW0603169KFKEA; ComponentLink1Description: Datasheet link; Supplier Part Number 1: 541-169KHCT-ND; Technology: Thick Film; Supplier 3: Mouser; Supplier Part Number 3: 71-CRCW0603-169K-E3
R35 = CMP-0025804-4: RES, 3.0, 5%, 0.1 W, AEC-Q200 Grade 0, 0603; Manufacturer: Vishay-Dale; Power_W: 100mW; TempCo: 200 ppm/C; Value_Code: 3R00; Value: 3.0; EIA_Code: E24; Res_ohm: 3; SizeX_mm: 1.6; SizeY_mm: 0.8; SizeZ_mm: 1; Value2: 0.1W; SizeArea_mm2: 1.28; CompType: Resistor; AEC Qualified: Y; VDC_V: 75V; AEC Category: Q200; AEC Grade: 0; ComponentLink1URL: http://www.vishay.com/docs/20035/dcrcwe3.pdf; Supplier Part Number 2: 47P3561; Supplier 2: Newark; Supplier Part Number 3: 71-CRCW0603J-3-E3; Supplier 3: Mouser; RoHS: E; Value1: 5%; MountType: SMT; Supplier 1: Digi-Key; PackageReference: 0603; Tolerance_%: 5%; PartNumber: CRCW06033R00JNEA; ComponentLink1Description: Datasheet link; Supplier Part Number 1: 541-3.0GCT-ND; Technology: Thick Film
R36 = CMP-0023091-5: RES, 3.00 k, 1%, 0.1 W, 0603; Manufacturer: Yageo; Power_W: 100mW; TempCo: 100 ppm/C; Value_Code: 3k00; Value: 3.00k; Res_ohm: 3k; SizeX_mm: 1.6; SizeY_mm: 0.8; SizeZ_mm: 1; Value2: 0.1W; SizeArea_mm2: 1.28; AEC Qualified: N; VDC_V: 75V; AEC Category: Q200; SizeAreaWB_mm2: 4.68; Supplier Part Number 2: 603-RC0603FR-073KL; Supplier 2: Mouser; Supplier Part Number 3: 1799337; Supplier 3: Farnell; RoHS: Y; Value1: 1%; MountType: SMT; Supplier 1: Digi-Key; PackageReference: 0603; Tolerance_%: 1%; CompType: Resistor; PartNumber: RC0603FR-073KL; ComponentLink1Description: Datasheet link; Supplier Part Number 1: 311-3.00KHRCT-ND; Technology: Thick Film; ComponentLink1URL: http://www.yageo.com/pdf/Pu-RC0603_51_PbFree_L_2.pdf; AEC Grade: N/A
R37 = CMP-0025925-5: RES, 47 k, 5%, 0.1 W, 0603; Manufacturer: Yageo; Value: 47k; Value_Code: 47k0; Power_W: 100mW; Value2: 0.1W; VDC_V: 75V; TempCo: 100 ppm/C; SizeArea_mm2: 1.28; SizeX_mm: 1.6; SizeY_mm: 0.8; SizeZ_mm: 1; EIA_Code: E24; AEC Category: Q200; AEC Qualified: N; SizeAreaWB_mm2: 4.68; CompType: Resistor; PartNumber: RC0603JR-0747KL; PackageReference: 0603; RoHS: Y; Res_ohm: 47k; Tolerance_%: 5%; Value1: 5%; MountType: SMT; Technology: Thick Film; ComponentLink1Description: Datasheet link; ComponentLink1URL: http://www.yageo.com/pdf/Pu-RC0603_51_PbFree_L_2.pdf; Supplier 1: Digi-Key; Supplier Part Number 1: 311-47KGRCT-ND; Supplier 2: Mouser; Supplier Part Number 2: 603-RC0603JR-0747KL; Supplier 3: Farnell; Supplier Part Number 3: 9233580; AEC Grade: N/A
R57 R58 = CMP-0025743-4: RES, 1.0, 5%, 0.1 W, AEC-Q200 Grade 0, 0603; Manufacturer: Vishay-Dale; Power_W: 100mW; TempCo: 200 ppm/C; Value_Code: 1R00; Value: 1.0; EIA_Code: E24; Res_ohm: 1; SizeX_mm: 1.6; SizeY_mm: 0.8; Value2: 0.1W; SizeArea_mm2: 1.28; AEC Qualified: Y; VDC_V: 75V; AEC Category: Q200; AEC Grade: 0; ComponentLink1URL: http://www.vishay.com/docs/20035/dcrcwe3.pdf; Supplier Part Number 2: 59M6759; Supplier 2: Newark; Supplier Part Number 3: 71-CRCW0603J-1-E3; Supplier 3: Mouser; RoHS: E; Value1: 5%; MountType: SMT; Supplier 1: Digi-Key; PackageReference: 0603; Tolerance_%: 5%; SizeZ_mm: 1; CompType: Resistor; PartNumber: CRCW06031R00JNEA; ComponentLink1Description: Datasheet link; Supplier Part Number 1: 541-1.0GCT-ND; Technology: Thick Film
TP1 TP2 = CMP-0055137-1: Test Point, Miniature, Red, TH; Manufacturer: Keystone; ContactFinish: Silver; CNHeader: FALSE; CT: TRUE; Green_Lifecycle: Active; Green_REACh: Passed; PartNumber: 5000; PackageReference: Red Miniature Testpoint; CompType: Test Point; RoHS: Y; MountType: TH; ComponentLink1Description: Datasheet URL; ComponentLink1URL: http://www.keyelco.com/userAssets/file/M60-2p60.pdf; Color: Red; Publisher: Texas Instruments; LatestRevisionDate: 26/05/2017; Supplier 1: Digi-Key; Supplier Part Number 1: 36-5000-ND; Supplier 2: Mouser; Supplier Part Number 2: 534-5000; Green_EU RoHS-2: Incomplete; Green_EU RoHS: Passed
TP3 = CMP-0055138-1: Test Point, Miniature, Black, TH; Manufacturer: Keystone; ContactFinish: Silver; Green_Lifecycle: Active; Green_REACh: Passed; CNHeader: FALSE; CT: TRUE; PartNumber: 5001; PackageReference: Black Miniature Testpoint; CompType: Test Point; RoHS: Y; MountType: TH; ComponentLink1Description: Datasheet URL; ComponentLink1URL: http://www.keyelco.com/userAssets/file/M60-2p60.pdf; Color: Black; Publisher: Texas Instruments; LatestRevisionDate: 26/05/2017; Supplier 1: Digi-Key; Supplier Part Number 1: 36-5001-ND; Supplier 2: Mouser; Supplier Part Number 2: 534-5001; Green_EU RoHS: Passed; Green_EU RoHS-2: Incomplete
U1 = CMP-0038835-1: 25 MHz Mixed Signal Microcontroller with 8 KB Flash, 1024 B SRAM and 29 GPIOs, -40 to 85 degC, 38-pin SOP (DA), Green (RoHS & no Sb/Br); Manufacturer: Texas Instruments; Flash(KB): 8; SVS: Yes; Timers - 16-bit: 3; SubFamily: 5 Series; Multiplier: 32x32; SRAM(B): 1024; USCI_B (I2C & SPI): 1; ADC: 10-bit SAR; GPIO: 29; Frequency(MHz): 25; Code_JEDEC: MO-153; ComponentLink1Description: Manufacturer URL; Brown Out Reset: Yes; ComponentLink3Description: Package Specification; PackageVersion: 4040066/F; Temp Sensor: Yes; Mounting Technology: Surface Mount; Watchdog: Yes; DMA: 3; Eco-Plan: Green (RoHS & no Sb/Br); ComponentLink2URL: http://www.ti.com/general/docs/lit/getliterature.tsp?genericPartNumber=MSP430F5132&fileType=pdf; PartNumber: MSP430F5132IDA; DatasheetVersion: SLAS619G; PackageReference: DA0038A; ComponentLink1URL: http://www.ti.com/; ComponentLink2Description: Datasheet; ADC Channels: 8; ComponentLink3URL: http://www.ti.com/lit/ml/mtss002e/mtss002e.pdf; USCI_A (UART/LIN/IrDA/SPI): 1; PackageDescription: 38-Pin Plastic Small-Outline Package, Body 6.10 x 12.50 mm, Pitch 0.65 mm; Comparators: Yes; Supplier Part Number 1: 296-29344-1-ND; Supplier 1: Digi-Key
U2 = CMP-0043093-2: Single-Channel ESD in 0402 Package With 10pF Capacitance and 6V Breakdown, DPY0002A (X1SON-2); Manufacturer: Texas Instruments; Alternate PartNumber: TPD1E10B06DPYT; SubFamily: ESD Solution; IEC 61000-4-2 Air-Gap(+/- kV): 30; Eco-Plan: TBD; IO Capacitance(Typ)(pF): 10; Breakdown Voltage(Min)(V): 6; AEC Category: Q200; AEC Qualified: N; CompType: IC; Green_Lifecycle: Active; Green_REACh: Passed; SizeAreaWB_mm2: 3.2; SizeArea_mm2: 0.6; SizeX_mm: 1.0; SizeZ_mm: 0.45; ComponentLink3Description: Online Datasheet; PackageVersion: revA, Apr-2010; PackageReference: DPY0002A; PackageDescription: X1SON-2; ComponentLink2URL: http://www.ti.com/product/tpd1e10b06; ComponentLink1URL: http://www.ti.com/lit/ds/symlink/tpd1e10b06.pdf; ComponentLink3URL: http://www.ti.com/product/tpd1e10b06/datasheet; IO Leakage Current(nA): 10; ComponentLink1Description: Datasheet Link; DatasheetVersion: SLLSEB1; ComponentLink2Description: Product Folder; PartNumber: TPD1E10B06DPYR; IEC 61000-4-2 Contact(+/- kV): 30; Alternate Manufacturer: Texas Instruments; Green_EU RoHS: Passed; Green_EU RoHS-2: Passed; MountType: SMT; RoHS: Y; SizeY_mm: 0.6
U3 U5 U15 = CMP-0075735-1: High/Low Side, Bi-Directional Zero-Drift Current Sense Amp w/ Enhanced PWM Rejection, PW0008A (TSSOP-8); Alternate Manufacturer: Texas Instruments; SizeX_mm: 6.4; CompType: IC; SizeAreaWB_mm2: 42.0; SizeZ_mm: 1.2; SizeY_mm: 3.0; U/M: EA; SizeArea_mm2: 19.2; PartNumber: INA240A2PWR; Publisher: Texas Instruments; PackageDescription: TSSOP-8; PackageReference: PW0008A; LatestRevisionDate: 2017-06-09; Alternate PartNumber: INA240A2PW; ComponentLink1Description: Datasheet Link; ComponentLink1URL: http://www.ti.com/lit/ds/symlink/ina240.pdf; MountType: SMT; Manufacturer: Texas Instruments; Supplier 1: Digi-Key; Supplier Part Number 1: 296-45089-1-ND
U4 = CMP-0074735-2: Factory Programmed Temperature Window Comparator, DRL0006A (SOT-OTHER-6); Alternate PartNumber: TMP303CDRLT; Manufacturer: Texas Instruments; SizeZ_mm: 0.6; SizeX_mm: 1.6; SizeArea_mm2: 2.56; CompType: IC; U/M: EA; SizeAreaWB_mm2: 6.76; ComponentLink1URL: http://www.ti.com/lit/ds/symlink/tmp303.pdf; Publisher: Texas Instruments; PackageDescription: SOT-OTHER-6; SizeY_mm: 1.6; PackageReference: DRL0006A; LatestRevisionDate: 2017-06-26; RoHS: Y; MountType: SMT; PartNumber: TMP303CDRLR; Alternate Manufacturer: Texas Instruments; ComponentLink1Description: Datasheet Link; Supplier Part Number 1: 296-47165-1-ND; Supplier 1: Digi-Key
U6 = CMP-0072802-2: 9.5-95V Wide Vin, 150mA Constant On-Time Non-Synchronous Buck Regulator, DGK0008A (VSSOP-8); Manufacturer: Texas Instruments; CompType: IC; AEC Category: Q200; AEC Qualified: N; SizeAreaWB_mm2: 23.6; SizeArea_mm2: 14.7; SizeX_mm: 4.9; SizeY_mm: 3; SizeZ_mm: 1.1; ComponentLink1Description: Datasheet Link; Code_JEDEC: MO-187-AA; ComponentLink1URL: http://www.ti.com/lit/ds/symlink/lm5009.pdf; RoHS: Y; PackageReference: DGK0008A; PackageDescription: VSSOP-8; PartNumber: LM5009MMX/NOPB; ComponentLink2Description: Product Folder; ComponentLink2URL: http://www.ti.com/product/lm5009; ComponentLink3Description: Online Datasheet; ComponentLink3URL: http://www.ti.com/product/lm5009/datasheet; MountType: SMT; Supplier Part Number 1: 296-35289-1-ND; Supplier 1: Digi-Key
U7 = CMP-0066225-2: Digital Ambient Light Sensor (ALS) with High Precision Human Eye Response, DNP0006A (USON-6); Alternate PartNumber: OPT3001DNPT; Alternate Manufacturer: Texas Instruments; Green_Lifecycle: Active; SizeAreaWB_mm2: 9.0; Green_REACh: Passed; U/M: EA; SizeZ_mm: 0.65; SizeX_mm: 2.0; SizeArea_mm2: 4.0; CompType: IC; ComponentLink1URL: http://www.ti.com/lit/ds/symlink/opt3001.pdf; Publisher: Texas Instruments; PackageDescription: USON-6; RoHS: Y; Footprint Path 6: C:\AltiumLibraries\Footprints\TI\.PcbLib; MountType: SMT; Green_EU RoHS-2: Passed; Manufacturer: Texas Instruments; Green_EU RoHS: Passed; PackageReference: DNP0006A; SizeY_mm: 2.0; LatestRevisionDate: 2017-06-09; PartNumber: OPT3001DNPR; ComponentLink1Description: Datasheet Link; Supplier Part Number 1: 296-38667-1-ND; Supplier 1: Digi-Key
U8 = CMP-0035592-1: Single Output LDO, 150 mA, Fixed 3.3 V Output, 2.5 to 24 V Input, with Ultra-Low IQ, 5-pin SOT-23 (DBV), -40 to 125 degC, Green (RoHS & no Sb/Br); Manufacturer: Texas Instruments; Fixed Output Options(V): 3.3; Vin(Max)(V): 24; Vin(Min)(V): 2.5; SubFamily: Single Channel LDO; Vdo(Typ)(mV): 400; Accuracy(%): 2; Iq(Typ)(mA): 0.003; Iout(Max)(A): 0.15; ComponentLink1URL: http://www.ti.com/; ComponentLink2URL: http://www.ti.com/general/docs/lit/getliterature.tsp?genericPartNumber=TLV70433&fileType=pdf; ComponentLink3URL: http://www.ti.com/litv/pdf/mpds018i; Mounting Technology: Surface Mount; ComponentLink2Description: Datasheet; Vout Adj(Max)(V): 3.3; PackageDescription: 5-Pin Plastic Small Outline, Body 1.60 Ãƒâ€” 2.90 mm, Pitch 0.95 mm; PackageVersion: 4073253-4/K; PartNumber: TLV70433DBVT; DatasheetVersion: SBVS148C; Eco-Plan: Green (RoHS & no Sb/Br); Code_JEDEC: MO-178; PackageReference: DBV0005A; ComponentLink3Description: Package Specification; ComponentLink1Description: Manufacturer URL; Vout Adj(Min)(V): 3.3; Supplier Part Number 1: 296-27946-1-ND; Supplier 1: Digi-Key
U16 = CMP-0043100-2: ESD Protection Array for AC Signal Data Interface, 2 Channels, -40 to +85 degC, 3-pin SC70 (DCK), Green (RoHS & no Sb/Br); Manufacturer: Texas Instruments; IO Leakage Current(nA): 50; IEC 61000-4-2 Contact(+/- kV): 8; IO Capacitance(Typ)(pF): 15; Breakdown Voltage(Min)(V): +/-14; SubFamily: ESD Solution; AEC Category: Q200; AEC Qualified: N; CompType: IC; SizeAreaWB_mm2: 9.3; SizeArea_mm2: 4.2; SizeX_mm: 2.1; SizeY_mm: 2; SizeZ_mm: 1.1; PartNumber: TPD2E007DCKR; PackageReference: DCK0003A; ComponentLink2URL: http://www.ti.com/product/TPD2E007; ComponentLink3URL: http://www.ti.com/product/TPD2E007/datasheet; ComponentLink1Description: Datasheet Link; IEC 61000-4-2 Air-Gap(+/- kV): 15; ComponentLink2Description: Product Folder; ComponentLink3Description: Online Datasheet; PackageVersion: revG, Jan-2007; Eco-Plan: Green (RoHS & no Sb/Br); ComponentLink1URL: http://www.ti.com/; PackageDescription: SOT-SC70-5; DatasheetVersion: SLVS796E; MountType: SMT; RoHS: Y